# EAGLE schematic Lab4 (EAGLE 7.0.0)
Starter project for EE445L Lab 4 DC Motor Control Lab Jonathan Valvano, September 20, 2014
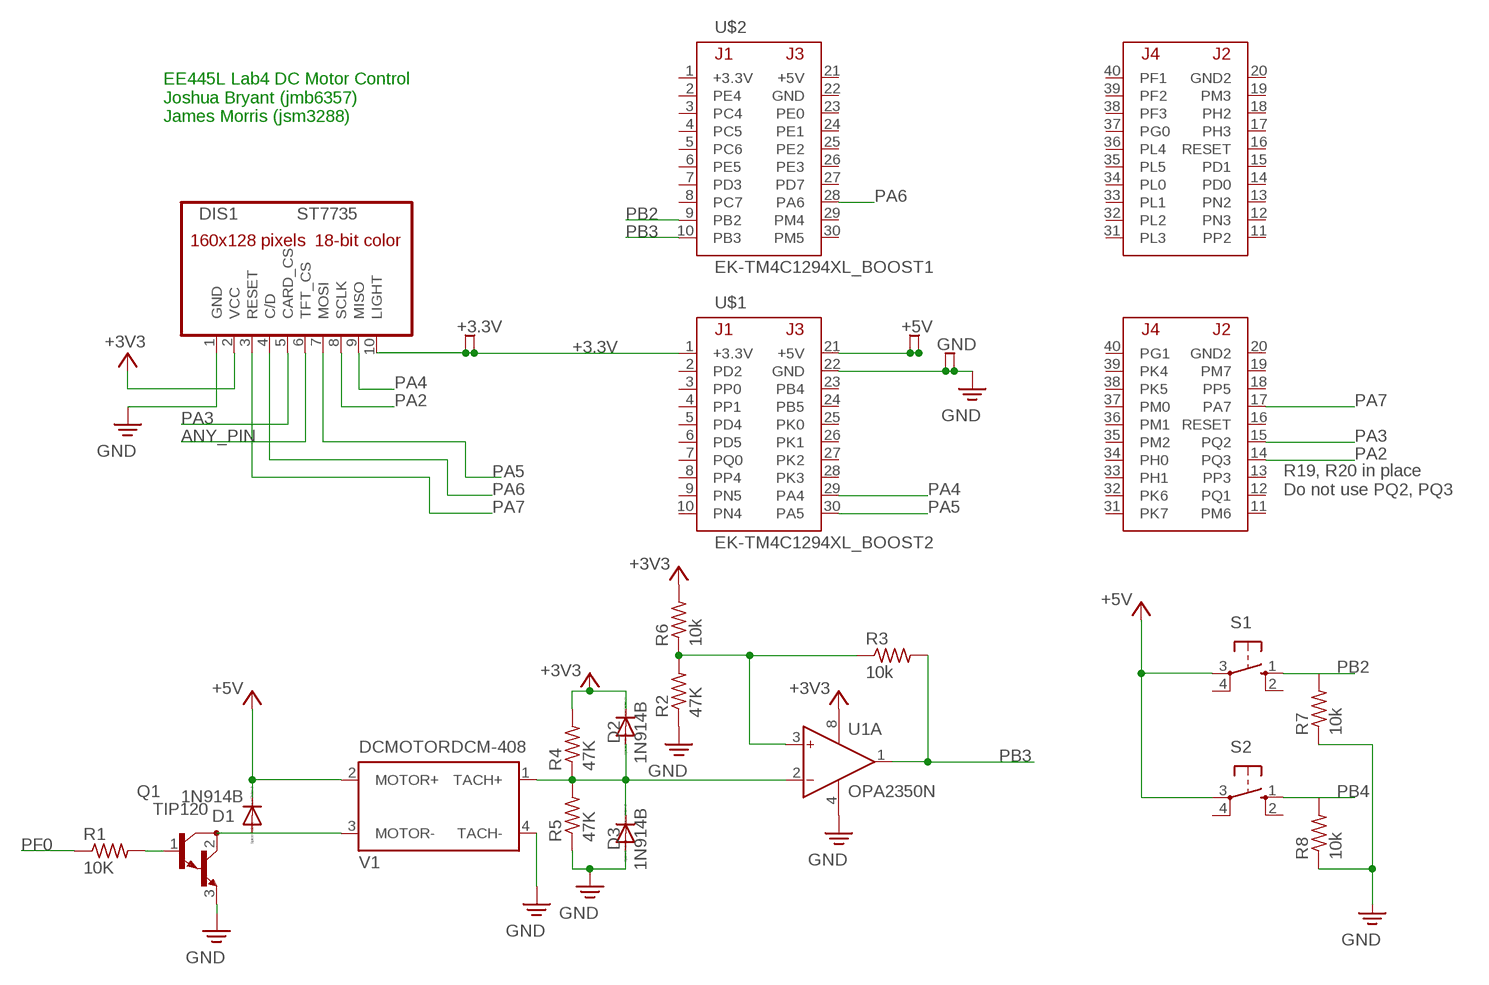
[diagram p0: schematic, sheet 1]

## Parts
+3.3V  TP2  [TP2]
+5V  TP2  [TP2]
D1  1N914B  [DO35-7]
D2  1N914B  [DO35-7]
D3  1N914B  [DO35-7]
DIS1  ST7735  [ST7735]
GND  TP2  [TP2]
Q1  TIP120  [TO220]
R1  10K  R-US_0204/2V  [0204V]
R2  47K  R-US_0204/2V  [0204V]
R3  10k  R-US_0204/2V  [0204V]
R4  47K  R-US_0204/2V  [0204V]
R5  47K  R-US_0204/2V  [0204V]
R6  10k  R-US_0204/2V  [0204V]
R7  10k  R-US_0204/2V  [0204V]
R8  10k  R-US_0204/2V  [0204V]
S1  B3F-1052  [B3F-10XX]
S2  B3F-1052  [B3F-10XX]
U1  OPA2350N  [DIL08]
U$1  EK-TM4C1294XL_BOOST2  [TM4C123LAUNCHPAD]
U$2  EK-TM4C1294XL_BOOST1  [TM4C123LAUNCHPAD]
V1  DCMOTORDCM-408  [DCMOTOR]

## Nets
+3.3V: +3.3V.MP1(TPB) +3.3V.MP(TPA) DIS1.2(VCC) DIS1.10(LIGHT) U$1.1(+3.3V) ; supply symbol labelled +3V3
+3V3: D1.C D2.C R4.2 R6.2 S1.3(P) S2.3(P) U1.8(P:V+) V1.2(MOTOR+) ; supply symbol labelled +5V
+5V: +5V.MP1(TPB) +5V.MP(TPA) U$1.21(+5V)
ANY_PIN: DIS1.6(TFT_CS)
GND: D3.A DIS1.1(GND) GND.MP1(TPB) GND.MP(TPA) R2.1 R5.1 U1.4(P:V-) U$1.22(GND) V1.4(TACH-)
N$1: D2.A D3.C R4.1 R5.2 U1.2(A:IN-) V1.1(TACH+)
N$2: D1.A Q1.2(C) V1.3(MOTOR-)
N$3: Q1.3(E) ; supply symbol labelled GND
N$4: Q1.1(B) R1.2
N$7: R2.2 R3.1 R6.1 U1.3(A:IN+)
N$8: R7.1 R8.1
PA2: DIS1.8(SCLK) U$1.14(PQ3)
PA3: DIS1.5(CARD_CS) U$1.15(PQ2)
PA4: DIS1.9(MISO) U$1.29(PA4)
PA5: DIS1.7(MOSI) U$1.30(PA5)
PA6: DIS1.4(C/D) U$2.28(PA6)
PA7: DIS1.3(RESET) U$1.17(PA7)
PB2: R7.2 S1.1(S)
PB3: R3.2 U1.1(A:OUT)
PB4: R8.2 S2.1(S)
PF0: R1.1
Unconnected: S1.2(S1) S1.4(P1) S2.2(S1) S2.4(P1) U1.5(B:IN+) U1.6(B:IN-) U1.7(B:OUT) U$1.2(PD2) U$1.3(PP0) U$1.4(PP1) U$1.5(PD4) U$1.6(PD5) U$1.7(PQ0) U$1.8(PP4) U$1.9(PN5) U$1.10(PN4) U$1.11(PM6) U$1.12(PQ1) U$1.13(PP3) U$1.16(RESET) U$1.18(PP5) U$1.19(PM7) U$1.23(PB4) U$1.24(PB5) U$1.25(PK0) U$1.26(PK1) U$1.27(PK2) U$1.28(PK3) U$1.31(PK7) U$1.32(PK6) U$1.33(PH1) U$1.34(PH0) U$1.35(PM2) U$1.36(PM1) U$1.37(PM0) U$1.38(PK5) U$1.39(PK4) U$1.40(PG1) U$2.2(PE4) U$2.3(PC4) U$2.4(PC5) U$2.5(PC6) U$2.6(PE5) U$2.7(PD3) U$2.8(PC7) U$2.9(PB2) U$2.10(PB3) U$2.11(PP2) U$2.12(PN3) U$2.13(PN2) U$2.14(PD0) U$2.15(PD1) U$2.16(RESET) U$2.17(PH3) U$2.18(PH2) U$2.19(PM3) U$2.23(PE0) U$2.24(PE1) U$2.25(PE2) U$2.26(PE3) U$2.27(PD7) U$2.29(PM4) U$2.30(PM5) U$2.31(PL3) U$2.32(PL2) U$2.33(PL1) U$2.34(PL0) U$2.35(PL5) U$2.36(PL4) U$2.37(PG0) U$2.38(PF3) U$2.39(PF2) U$2.40(PF1)

## Notes on the sheet
- EE445L Lab4 DC Motor Control
  Joshua Bryant (jmb6357)
  James Morris (jsm3288)
- R19, R20 in place
  Do not use PQ2, PQ3

## Power pins joined to a net without a drawn wire
+3.3V: U$2.1(+3.3V)
+5V: U$2.21(+5V)
GND: U$2.22(GND)
GND2: U$1.20(GND2) U$2.20(GND2)

## Library data of the parts
+3.3V +5V GND = EE445L:TP2: Low-cost test point Made with two 0.8mm holes.
D1-D3 = EE445L:1N914: DIODE high speed (Philips) 1N914
DIS1 = EE445L:ST7735: Sitronix ST7735R 18-bit color, 1.8" TFT LCD display, 128*160, http://www.adafruit.com/products/358 // Backlight (pin 10) connected to +3.3 V // MISO (pin 9) PA4 (SSI0Rx) // SCK (pin 8) connected to PA2 (SSI0Clk) // MOSI (pin 7) connected to PA5 (SSI0Tx) // TFT_CS (pin 6) connected to PA3 (SSI0Fss) // CARD_CS (pin 5) connected to PD7 GPIO output(for SDC) // Data/Command (pin 4) connected to PA6 (GPIO), high for data, low for command // RESET (pin 3) connected to PA7 (GPIO) // VCC (pin 2) connected to +3.3 V // Gnd (pin 1) connected to ground; OC_FARNELL: unknown; OC_NEWARK: unknown
Q1 = EE445L:TIP120: NPN Darlington Transistor
R1-R8 = rcl:R-US_: RESISTOR, American symbol
S1 S2 = EE445L:B3F-1052: OMRON SWITCH 1.1mm holes; MPN: B3F-1000; OC_FARNELL: 176432; OC_NEWARK: 36M3542
U1 = EE445L:OPA2350: 2.7V to 5.5V Rail-to-Rail I/O Dual Amplifier High-Speed 38MHz, Single-Supply, slew rate 22V/us, 500uV offset, 4uV noise; OC_FARNELL: unknown; OC_NEWARK: unknown
U$1 = EE445L:EK-TM4C1294XL_BOOST2: Booster pack 2, Texas Instruments TM4C1294 Connected LaunchPad www.ti.com/tool/ek-tm4c1294xl This board is based on the TM4C1294NCPDT microcontroller, which is a120MHz 32-bit ARM Cortex-M4 CPU with floating point, 1MB Flash, 256KB SRAM, 6KB EEPROM, Integrated 10/100 Ethernet MAC+PHY, data protection hardware, 8x 32-bit timers, dual 12-bit 2MSPS ADCs, motion control PWMs, USB H/D/O
U$2 = EE445L:EK-TM4C1294XL_BOOST1: Booster pack 1, Texas Instruments TM4C1294 Connected LaunchPad www.ti.com/tool/ek-tm4c1294xl This board is based on the TM4C1294NCPDT microcontroller, which is a120MHz 32-bit ARM Cortex-M4 CPU with floating point, 1MB Flash, 256KB SRAM, 6KB EEPROM, Integrated 10/100 Ethernet MAC+PHY, data protection hardware, 8x 32-bit timers, dual 12-bit 2MSPS ADCs, motion control PWMs, USB H/D/O
V1 = EE445L:DCMOTOR: DC motor DC motor with tachometer, www.allelectronics.com CAT# DCM-408. The two wires located near the shaft are the brushed DC motor, and the two wires going under the plastic cap are the tachometer. Pin 1, yellow, motor+ Pin 2, red, tach + Pin 3, blue, tach - Pin 4, green, motor -; OC_FARNELL: unknown; OC_NEWARK: unknown

## Net classes
0 default: clearance 0.205 mm